# EAGLE design clock_arm (EAGLE 5.11)
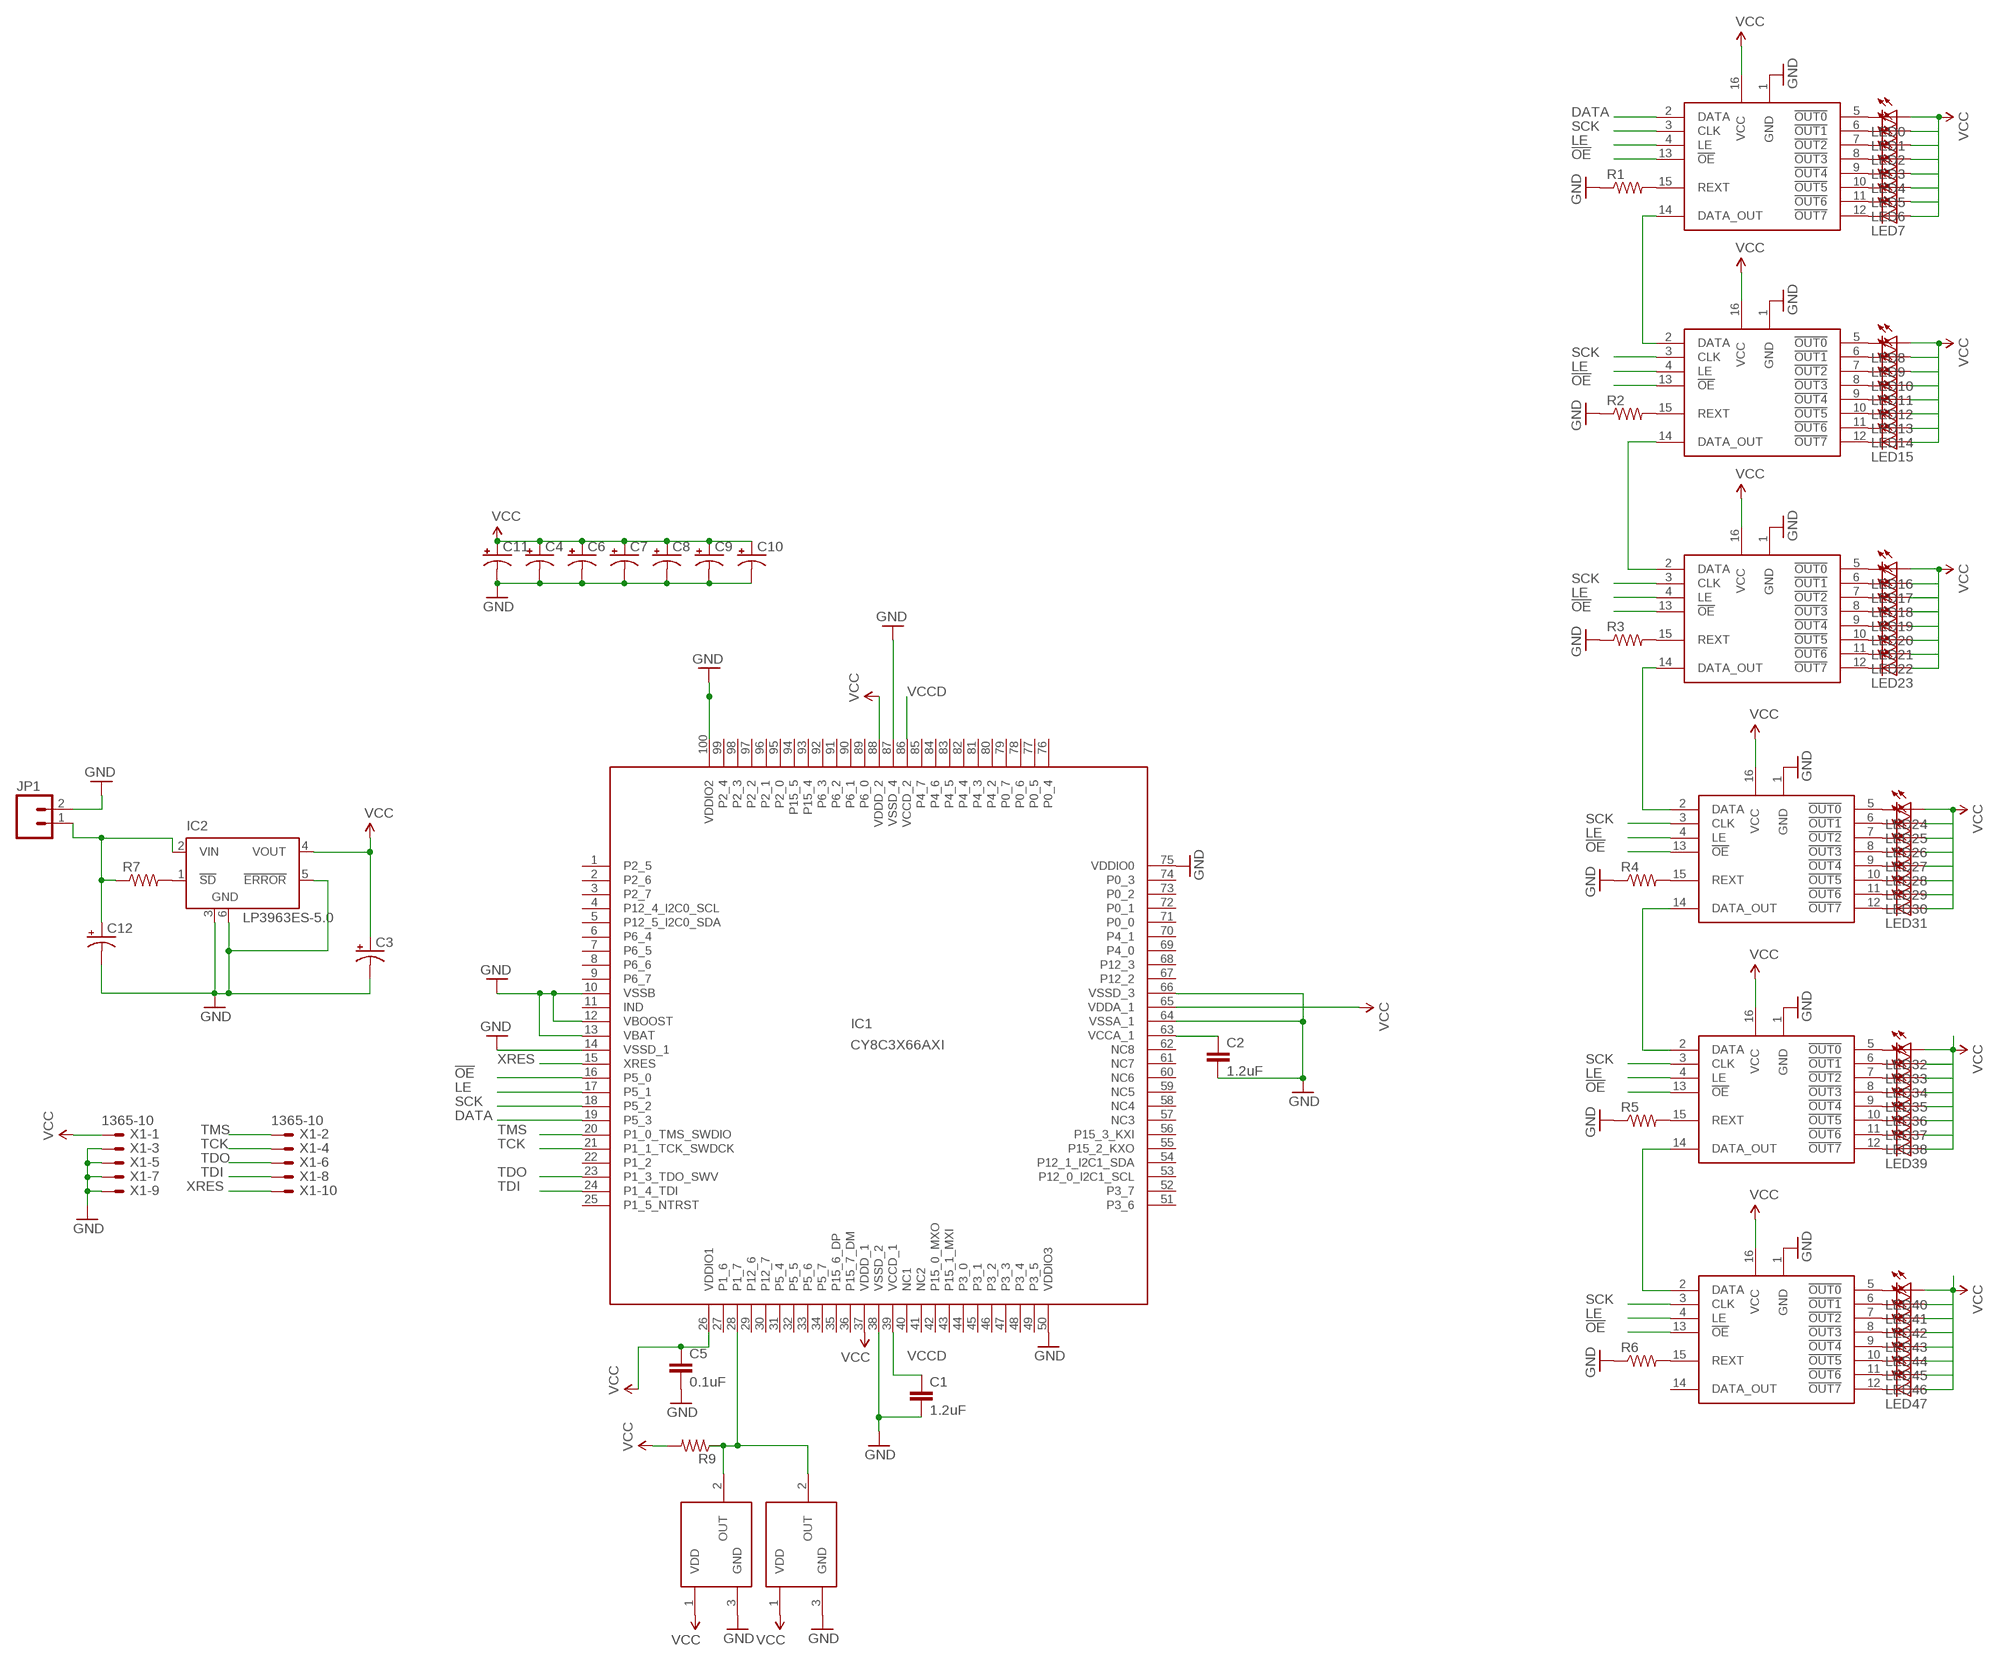
[diagram p0: schematic, sheet 1]

## Parts
C1  1.2uF  CAP0805  [0805]
C2  1.2uF  CAP0805  [0805]
C3  CAP_POL7343  [EIA7343]
C4  CAP_POL1206  [EIA3216]
C5  0.1uF  CAP0805  [0805]
C6  CAP_POL1206  [EIA3216]
C7  CAP_POL1206  [EIA3216]
C8  CAP_POL1206  [EIA3216]
C9  CAP_POL1206  [EIA3216]
C10  CAP_POL1206  [EIA3216]
C11  CAP_POL1206  [EIA3216]
C12  CAP_POL7343  [EIA7343]
IC1  CY8C3X66AXI  [TQFP-100]
IC2  LP3963ES-5.0  [TO263-5]
JP1  M02PTH  [1X02]
LED0  LG_T679-E1F1-1  [PLCC2]
LED1  LG_T679-E1F1-1  [PLCC2]
LED2  LG_T679-E1F1-1  [PLCC2]
LED3  LG_T679-E1F1-1  [PLCC2]
LED4  LG_T679-E1F1-1  [PLCC2]
LED5  LG_T679-E1F1-1  [PLCC2]
LED6  LG_T679-E1F1-1  [PLCC2]
LED7  LG_T679-E1F1-1  [PLCC2]
LED8  LG_T679-E1F1-1  [PLCC2]
LED9  LG_T679-E1F1-1  [PLCC2]
LED10  LG_T679-E1F1-1  [PLCC2]
LED11  LG_T679-E1F1-1  [PLCC2]
LED12  LG_T679-E1F1-1  [PLCC2]
LED13  LG_T679-E1F1-1  [PLCC2]
LED14  LG_T679-E1F1-1  [PLCC2]
LED15  LG_T679-E1F1-1  [PLCC2]
LED16  LG_T679-E1F1-1  [PLCC2]
LED17  LG_T679-E1F1-1  [PLCC2]
LED18  LG_T679-E1F1-1  [PLCC2]
LED19  LG_T679-E1F1-1  [PLCC2]
LED20  LG_T679-E1F1-1  [PLCC2]
LED21  LG_T679-E1F1-1  [PLCC2]
LED22  LG_T679-E1F1-1  [PLCC2]
LED23  LG_T679-E1F1-1  [PLCC2]
LED24  LG_T679-E1F1-1  [PLCC2]
LED25  LG_T679-E1F1-1  [PLCC2]
LED26  LG_T679-E1F1-1  [PLCC2]
LED27  LG_T679-E1F1-1  [PLCC2]
LED28  LG_T679-E1F1-1  [PLCC2]
LED29  LG_T679-E1F1-1  [PLCC2]
LED30  LG_T679-E1F1-1  [PLCC2]
LED31  LG_T679-E1F1-1  [PLCC2]
LED32  LG_T679-E1F1-1  [PLCC2]
LED33  LG_T679-E1F1-1  [PLCC2]
LED34  LG_T679-E1F1-1  [PLCC2]
LED35  LG_T679-E1F1-1  [PLCC2]
LED36  LG_T679-E1F1-1  [PLCC2]
LED37  LG_T679-E1F1-1  [PLCC2]
LED38  LG_T679-E1F1-1  [PLCC2]
LED39  LG_T679-E1F1-1  [PLCC2]
LED40  LG_T679-E1F1-1  [PLCC2]
LED41  LG_T679-E1F1-1  [PLCC2]
LED42  LG_T679-E1F1-1  [PLCC2]
LED43  LG_T679-E1F1-1  [PLCC2]
LED44  LG_T679-E1F1-1  [PLCC2]
LED45  LG_T679-E1F1-1  [PLCC2]
LED46  LG_T679-E1F1-1  [PLCC2]
LED47  LG_T679-E1F1-1  [PLCC2]
R1  RESISTOR0603-RES  [0603-RES]
R2  RESISTOR0603-RES  [0603-RES]
R3  RESISTOR0603-RES  [0603-RES]
R4  RESISTOR0603-RES  [0603-RES]
R5  RESISTOR0603-RES  [0603-RES]
R6  RESISTOR0603-RES  [0603-RES]
R7  RESISTOR0603-RES  [0603-RES]
R9  RESISTOR0603-RES  [0603-RES]
U$1  TLC5916TSSOP  [TSSOP-16]
U$2  TLC5916TSSOP  [TSSOP-16]
U$3  TLC5916TSSOP  [TSSOP-16]
U$4  TLC5916TSSOP  [TSSOP-16]
U$5  TLC5916TSSOP  [TSSOP-16]
U$6  TLC5916TSSOP  [TSSOP-16]
U$7  SS351AT  [SOT23-3]
U$9  SS351AT  [SOT23-3]
X1  1365-10  [1365-10]

## Nets
!OE: IC1.16(P5_0) U$1.13(!OE) U$2.13(!OE) U$3.13(!OE) U$4.13(!OE) U$5.13(!OE) U$6.13(!OE)
DATA: IC1.19(P5_3) U$1.2(DATA)
GND: C1.2 C2.2 C3.C(-) C4.C(-) C5.2 C6.C(-) C7.C(-) C8.C(-) C9.C(-) C10.C(-) C11.C(-) C12.C(-) IC1.10(VSSB) IC1.12(VBOOST) IC1.13(VBAT) IC1.14(VSSD_1) IC1.38(VSSD_2) IC1.50(VDDIO3) IC1.64(VSSA_1) IC1.66(VSSD_3) IC1.75(VDDIO0) IC1.87(VSSD_4) IC1.100(VDDIO2) IC2.3(GND) IC2.5(!ERROR) IC2.6(GND) JP1.2 R1.1 R2.1 R3.1 R4.1 R5.1 R6.1 U$1.1(GND) U$2.1(GND) U$3.1(GND) U$4.1(GND) U$5.1(GND) U$6.1(GND) U$7.3(GND) U$9.3(GND) X1.3 X1.5 X1.7 X1.9
LE: IC1.17(P5_1) U$1.4(LE) U$2.4(LE) U$3.4(LE) U$4.4(LE) U$5.4(LE) U$6.4(LE)
N$1: LED0.C U$1.5(!OUT0)
N$2: LED1.C U$1.6(!OUT1)
N$3: LED2.C U$1.7(!OUT2)
N$4: LED3.C U$1.8(!OUT3)
N$5: LED4.C U$1.9(!OUT4)
N$6: LED5.C U$1.10(!OUT5)
N$7: LED6.C U$1.11(!OUT6)
N$8: LED7.C U$1.12(!OUT7)
N$9: R1.2 U$1.15(REXT)
N$10: LED8.C U$2.5(!OUT0)
N$11: LED9.C U$2.6(!OUT1)
N$12: LED10.C U$2.7(!OUT2)
N$13: LED11.C U$2.8(!OUT3)
N$14: LED12.C U$2.9(!OUT4)
N$15: LED13.C U$2.10(!OUT5)
N$16: LED14.C U$2.11(!OUT6)
N$17: LED15.C U$2.12(!OUT7)
N$18: R2.2 U$2.15(REXT)
N$19: LED16.C U$3.5(!OUT0)
N$20: LED17.C U$3.6(!OUT1)
N$21: LED18.C U$3.7(!OUT2)
N$22: LED19.C U$3.8(!OUT3)
N$23: LED20.C U$3.9(!OUT4)
N$24: LED21.C U$3.10(!OUT5)
N$25: LED22.C U$3.11(!OUT6)
N$26: LED23.C U$3.12(!OUT7)
N$27: R3.2 U$3.15(REXT)
N$28: LED24.C U$4.5(!OUT0)
N$29: LED25.C U$4.6(!OUT1)
N$30: LED26.C U$4.7(!OUT2)
N$31: LED27.C U$4.8(!OUT3)
N$32: LED28.C U$4.9(!OUT4)
N$33: LED29.C U$4.10(!OUT5)
N$34: LED30.C U$4.11(!OUT6)
N$35: LED31.C U$4.12(!OUT7)
N$36: R4.2 U$4.15(REXT)
N$37: U$1.14(DATA_OUT) U$2.2(DATA)
N$38: U$2.14(DATA_OUT) U$3.2(DATA)
N$39: U$3.14(DATA_OUT) U$4.2(DATA)
N$40: LED32.C U$5.5(!OUT0)
N$41: LED33.C U$5.6(!OUT1)
N$42: LED34.C U$5.7(!OUT2)
N$43: LED35.C U$5.8(!OUT3)
N$44: LED36.C U$5.9(!OUT4)
N$45: LED37.C U$5.10(!OUT5)
N$46: LED38.C U$5.11(!OUT6)
N$47: LED39.C U$5.12(!OUT7)
N$48: R5.2 U$5.15(REXT)
N$49: U$4.14(DATA_OUT) U$5.2(DATA)
N$50: LED40.C U$6.5(!OUT0)
N$51: LED41.C U$6.6(!OUT1)
N$52: LED42.C U$6.7(!OUT2)
N$53: LED43.C U$6.8(!OUT3)
N$54: LED44.C U$6.9(!OUT4)
N$55: LED45.C U$6.10(!OUT5)
N$56: LED46.C U$6.11(!OUT6)
N$57: LED47.C U$6.12(!OUT7)
N$58: R6.2 U$6.15(REXT)
N$59: U$5.14(DATA_OUT) U$6.2(DATA)
N$60: C12.A(+) IC2.2(VIN) JP1.1 R7.1
N$61: IC2.1(!SD) R7.2
N$80: C2.1 IC1.63(VCCA_1)
N$81: IC1.28(P1_7) R9.1 U$7.2(OUT) U$9.2(OUT)
SCK: IC1.18(P5_2) U$1.3(CLK) U$2.3(CLK) U$3.3(CLK) U$4.3(CLK) U$5.3(CLK) U$6.3(CLK)
TCK: IC1.21(P1_1_TCK_SWDCK) X1.4
TDI: IC1.24(P1_4_TDI) X1.8
TDO: IC1.23(P1_3_TDO_SWV) X1.6
TMS: IC1.20(P1_0_TMS_SWDIO) X1.2
VCC: C3.A(+) C4.A(+) C5.1 C6.A(+) C7.A(+) C8.A(+) C9.A(+) C10.A(+) C11.A(+) IC1.26(VDDIO1) IC1.37(VDDD_1) IC1.65(VDDA_1) IC1.88(VDDD_2) IC2.4(VOUT) LED0.A LED1.A LED2.A LED3.A LED4.A LED5.A LED6.A LED7.A LED8.A LED9.A LED10.A LED11.A LED12.A LED13.A LED14.A LED15.A LED16.A LED17.A LED18.A LED19.A LED20.A LED21.A LED22.A LED23.A LED24.A LED25.A LED26.A LED27.A LED28.A LED29.A LED30.A LED31.A LED32.A LED33.A LED34.A LED35.A LED36.A LED37.A LED38.A LED39.A LED40.A LED41.A LED42.A LED43.A LED44.A LED45.A LED46.A LED47.A R9.2 U$1.16(VCC) U$2.16(VCC) U$3.16(VCC) U$4.16(VCC) U$5.16(VCC) U$6.16(VCC) U$7.1(VDD) U$9.1(VDD) X1.1
VCCD: C1.1 IC1.39(VCCD_1) IC1.86(VCCD_2)
XRES: IC1.15(XRES) X1.10
Unconnected: IC1.1(P2_5) IC1.2(P2_6) IC1.3(P2_7) IC1.4(P12_4_I2C0_SCL) IC1.5(P12_5_I2C0_SDA) IC1.6(P6_4) IC1.7(P6_5) IC1.8(P6_6) IC1.9(P6_7) IC1.11(IND) IC1.22(P1_2) IC1.25(P1_5_NTRST) IC1.27(P1_6) IC1.29(P12_6) IC1.30(P12_7) IC1.31(P5_4) IC1.32(P5_5) IC1.33(P5_6) IC1.34(P5_7) IC1.35(P15_6_DP) IC1.36(P15_7_DM) IC1.40(NC1) IC1.41(NC2) IC1.42(P15_0_MXO) IC1.43(P15_1_MXI) IC1.44(P3_0) IC1.45(P3_1) IC1.46(P3_2) IC1.47(P3_3) IC1.48(P3_4) IC1.49(P3_5) IC1.51(P3_6) IC1.52(P3_7) IC1.53(P12_0_I2C1_SCL) IC1.54(P12_1_I2C1_SDA) IC1.55(P15_2_KXO) IC1.56(P15_3_KXI) IC1.57(NC3) IC1.58(NC4) IC1.59(NC5) IC1.60(NC6) IC1.61(NC7) IC1.62(NC8) IC1.67(P12_2) IC1.68(P12_3) IC1.69(P4_0) IC1.70(P4_1) IC1.71(P0_0) IC1.72(P0_1) IC1.73(P0_2) IC1.74(P0_3) IC1.76(P0_4) IC1.77(P0_5) IC1.78(P0_6) IC1.79(P0_7) IC1.80(P4_2) IC1.81(P4_3) IC1.82(P4_4) IC1.83(P4_5) IC1.84(P4_6) IC1.85(P4_7) IC1.89(P6_0) IC1.90(P6_1) IC1.91(P6_2) IC1.92(P6_3) IC1.93(P15_4) IC1.94(P15_5) IC1.95(P2_0) IC1.96(P2_1) IC1.97(P2_2) IC1.98(P2_3) IC1.99(P2_4) U$6.14(DATA_OUT)

## Library data of the parts
C1 C2 C5 = SparkFun:CAP: Capacitor Standard 0603 ceramic capacitor, and 0.1" leaded capacitor.
C3 C4 C6-C12 = SparkFun:CAP_POL: Capacitor Polarized These are standard SMD and PTH capacitors. Normally 10uF, 47uF, and 100uF in electrolytic and tantalum varieties. Always verify the external diameter of the through hole cap, it varies with capacity, voltage, and manufacturer. The EIA devices should be standard.
IC1 = PSoC3:CY8C3X66AXI: CY8C_pins edit this description Auto generated by make-symbol-device-package-bsdl.ulp Rev. 34 Source: CY8C_pins.txt
IC2 = linear:LP3963?*: 3A Fast Ultra Low Dropout Linear Regulator Source: http://cache.national.com/ds/LP/LP3963.pdf
JP1 = SparkFun:M02: Header 2 Standard 2-pin 0.1" header. Use with straight break away headers (SKU : PRT-00116), right angle break away headers (PRT-00553), swiss pins (PRT-00743), machine pins (PRT-00117), and female headers (PRT-00115). Molex polarized connector foot print use with SKU : PRT-08233 with associated crimp pins and housings.
LED0 LED1-LED47 = led:*_T679-?-1: LC TOPLED® Low Current LED Source: http://catalog.osram-os.com .. LG_LS_LY_T679_OBS.pdf; COLOR: green
R1-R7 R9 = SparkFun:RESISTOR: Resistor Basic schematic elements and footprints for 0603, 1206, and PTH resistors.
U$1-U$6 = SparkFun:TLC5916
U$7 U$9 = SparkFun:SS351AT
X1 = con-leotronics:1365-10: DUAL ROW STRAIGHT HEADER 1364 SERIES. 1.27mm x 1.27mm. Without Fixing Post. SMT Source: http://www.leotronics.co.uk/Conexcon/Data%20Sheets/sec.%20A/1364ing.pdf; OC_FARNELL: unknown; OC_NEWARK: unknown

## Board
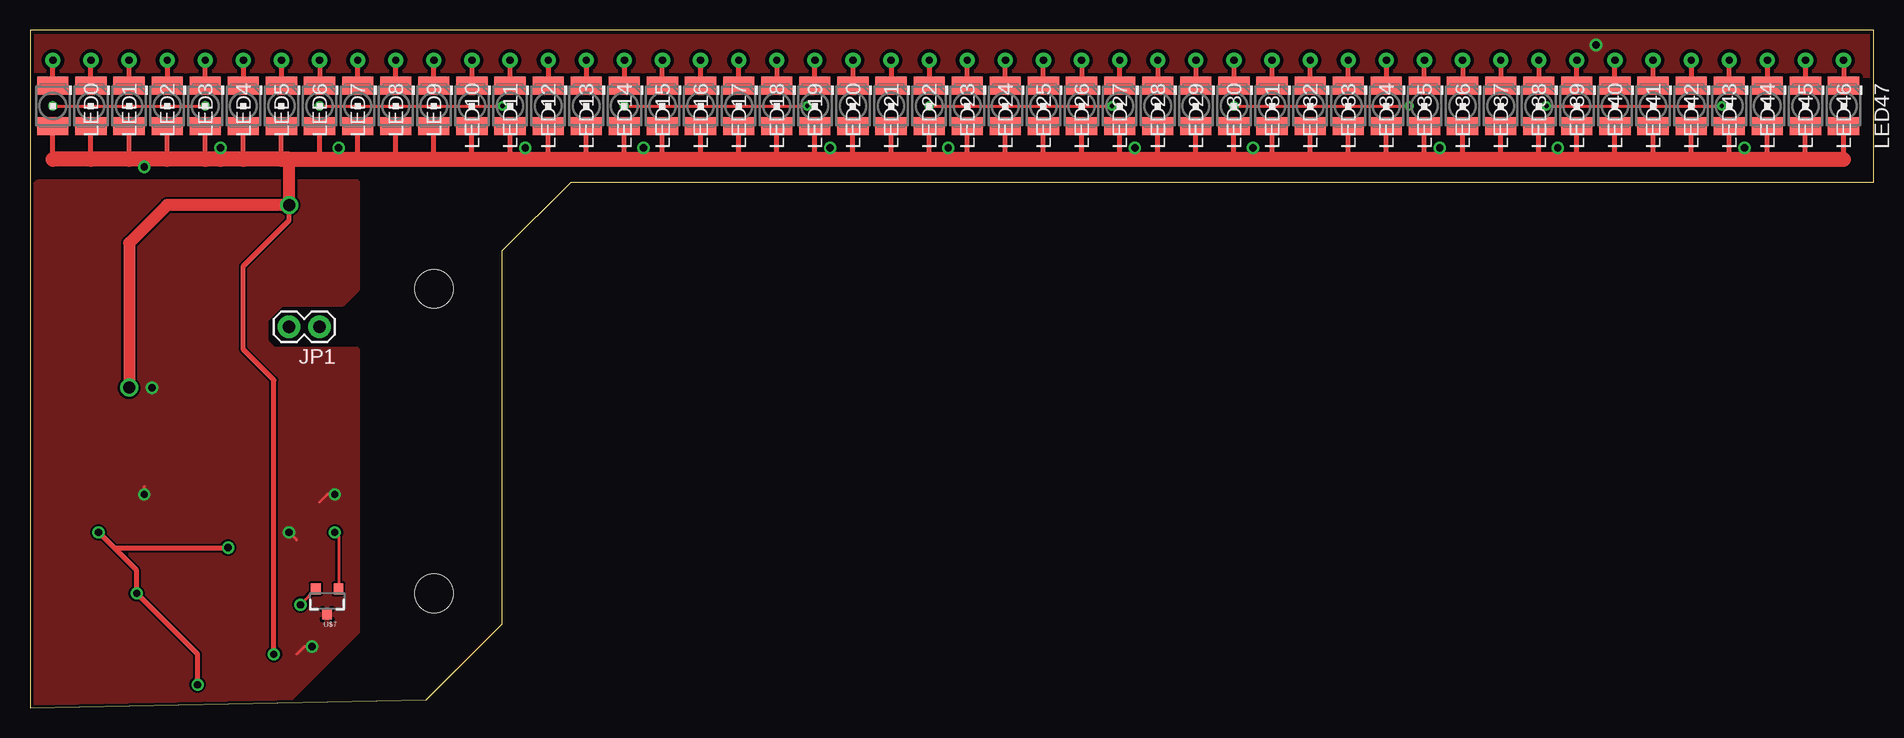
[diagram p1: board, top side]
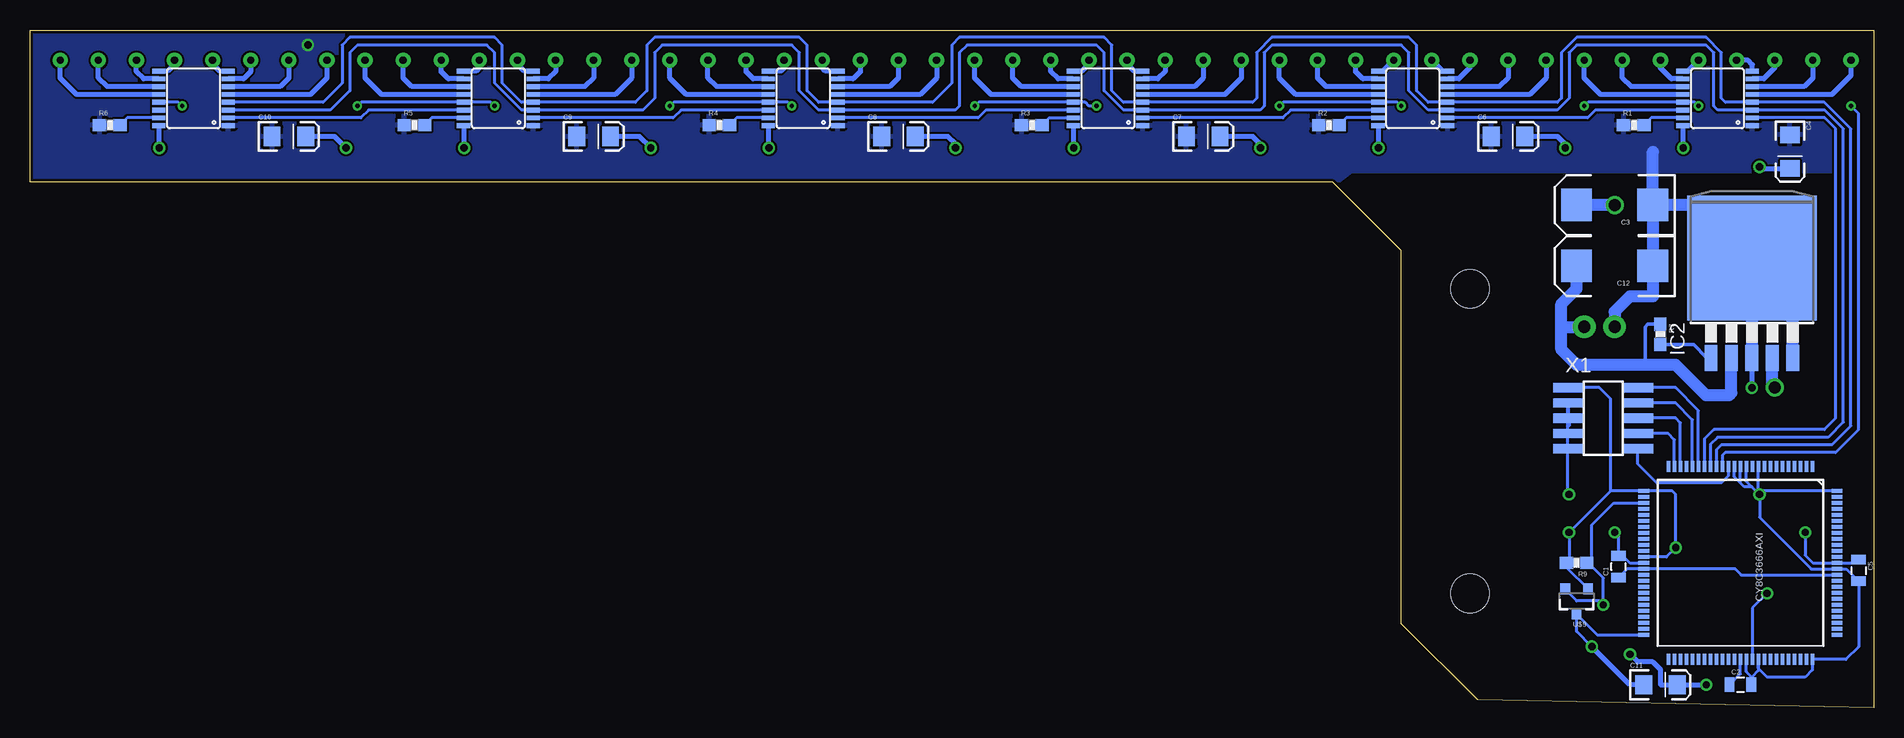
[diagram p2: board, bottom side, seen from below]

Size 153.65 x 56.5 mm. Coordinates in mm from the lower left corner, seen from the top.
Outline: 0,0 33.02,0.64 39.37,6.98 39.37,38.1 45.09,43.82 153.65,43.82 153.65,56.5 0,56.5 0,0
Copper layers (1*16): Top 0.035mm / dielectric 1.5mm / Bottom 0.035mm
Design rules "default *": minimum track width 10mil, minimum drill 14mil, track to track 7mil, track to pad 7mil, pad to pad 7mil, via to via 7mil, smd to smd 7mil, copper to edge 10mil, drill to drill 8mil, minimum pad ring 10mil, minimum via ring 8mil, stop-mask expansion 4mil, vias tented up to drill 0mil, thermal gap 10mil
Holes 3.2 mm at 33.66,9.53 33.66,34.92

### Footprints (pad centres in the part's own frame; a part is rotated, then mirrored left to right if it is on the bottom)
0805 = smd 0.8 x 1.2: 1 -0.9,0; 2 0.9,0
EIA7343 = smd 2.55 x 2.7: A 3.17,0; C -3.17,0
EIA3216 = smd 1.4 x 1.6: A 1.4,0; C -1.4,0
TQFP-100 = smd 0.9 x 0.3: 1 -8.05,6; 2 -8.05,5.5; 3 -8.05,5; 4 -8.05,4.5; 5 -8.05,4; 6 -8.05,3.5; 7 -8.05,3; 8 -8.05,2.5; 9 -8.05,2; 10 -8.05,1.5; 11 -8.05,1; 12 -8.05,0.5; 13 -8.05,0; 14 -8.05,-0.5; 15 -8.05,-1; 16 -8.05,-1.5; 17 -8.05,-2; 18 -8.05,-2.5; 19 -8.05,-3; 20 -8.05,-3.5; 21 -8.05,-4; 22 -8.05,-4.5; 23 -8.05,-5; 24 -8.05,-5.5; 25 -8.05,-6; 51 8.05,-6; 52 8.05,-5.5; 53 8.05,-5; 54 8.05,-4.5; 55 8.05,-4; 56 8.05,-3.5; 57 8.05,-3; 58 8.05,-2.5; 59 8.05,-2; 60 8.05,-1.5; 61 8.05,-1; 62 8.05,-0.5; 63 8.05,0; 64 8.05,0.5; 65 8.05,1; 66 8.05,1.5; 67 8.05,2; 68 8.05,2.5; 69 8.05,3; 70 8.05,3.5; 71 8.05,4; 72 8.05,4.5; 73 8.05,5; 74 8.05,5.5; 75 8.05,6 | smd 0.3 x 0.9: 26 -6,-8.05; 27 -5.5,-8.05; 28 -5,-8.05; 29 -4.5,-8.05; 30 -4,-8.05; 31 -3.5,-8.05; 32 -3,-8.05; 33 -2.5,-8.05; 34 -2,-8.05; 35 -1.5,-8.05; 36 -1,-8.05; 37 -0.5,-8.05; 38 0,-8.05; 39 0.5,-8.05; 40 1,-8.05; 41 1.5,-8.05; 42 2,-8.05; 43 2.5,-8.05; 44 3,-8.05; 45 3.5,-8.05; 46 4,-8.05; 47 4.5,-8.05; 48 5,-8.05; 49 5.5,-8.05; 50 6,-8.05; 76 6,8.05; 77 5.5,8.05; 78 5,8.05; 79 4.5,8.05; 80 4,8.05; 81 3.5,8.05; 82 3,8.05; 83 2.5,8.05; 84 2,8.05; 85 1.5,8.05; 86 1,8.05; 87 0.5,8.05; 88 0,8.05; 89 -0.5,8.05; 90 -1,8.05; 91 -1.5,8.05; 92 -2,8.05; 93 -2.5,8.05; 94 -3,8.05; 95 -3.5,8.05; 96 -4,8.05; 97 -4.5,8.05; 98 -5,8.05; 99 -5.5,8.05; 100 -6,8.05
TO263-5 = smd 1.067 x 2.159: 1 -3.404,-5.791; 2 -1.702,-5.791; 3 0,-5.791; 4 1.702,-5.791; 5 3.404,-5.791 | smd 10.8 x 10.41: 6 0,2.54
1X02 = drill 1.016 pad 1.88 round: 1 0,0; 2 2.54,0
PLCC2 = smd 2.6 x 1.5: A 0,1.7; C 0,-1.7
0603-RES = smd 1.1 x 1: 1 -0.85,0; 2 0.85,0
TSSOP-16 = smd 0.4 x 1.1: 1 -2.275,-2.9; 2 -1.625,-2.9; 3 -0.975,-2.9; 4 -0.325,-2.9; 5 0.325,-2.9; 6 0.975,-2.9; 7 1.625,-2.9; 8 2.275,-2.9; 9 2.275,2.9; 10 1.625,2.9; 11 0.975,2.9; 12 0.325,2.9; 13 -0.325,2.9; 14 -0.975,2.9; 15 -1.625,2.9; 16 -2.275,2.9
SOT23-3 = smd 0.8 x 0.9: 1 -0.95,-1; 2 0.95,-1; 3 0,1.1
1365-10 = smd 0.76 x 2.4: 1 -2.54,-2.95; 2 -2.54,2.95; 3 -1.27,-2.95; 4 -1.27,2.95; 5 0,-2.95; 6 0,2.95; 7 1.27,-2.95; 8 1.27,2.95; 9 2.54,-2.95; 10 2.54,2.95

### Placement (x,y rotation side)
C1  21.27,11.75 90 bottom
C2  11.11,1.91 0 bottom
C3  21.59,41.91 180 bottom
C4  6.98,46.36 270 bottom
C5  1.27,11.43 270 bottom
C6  30.48,47.62 0 bottom
C7  55.88,47.62 0 bottom
C8  81.28,47.62 0 bottom
C9  106.68,47.62 0 bottom
C10  132.08,47.62 0 bottom
C11  17.78,1.91 0 bottom
C12  21.59,36.83 180 bottom
IC1  11.11,12.07 270 bottom
IC2  10.16,34.92 0 bottom
JP1  24.13,31.75 180 top
LED0  1.9,50.16 180 top
LED1  5.08,50.16 180 top
LED2  8.26,50.16 180 top
LED3  11.43,50.16 180 top
LED4  14.6,50.16 180 top
LED5  17.78,50.16 180 top
LED6  20.95,50.16 180 top
LED7  24.13,50.16 180 top
LED8  27.3,50.16 180 top
LED9  30.48,50.16 180 top
LED10  33.66,50.16 180 top
LED11  36.83,50.16 180 top
LED12  40.01,50.16 180 top
LED13  43.18,50.16 180 top
LED14  46.35,50.16 180 top
LED15  49.53,50.16 180 top
LED16  52.71,50.16 180 top
LED17  55.88,50.16 180 top
LED18  59.05,50.16 180 top
LED19  62.23,50.16 180 top
LED20  65.41,50.16 180 top
LED21  68.58,50.16 180 top
LED22  71.75,50.16 180 top
LED23  74.93,50.16 180 top
LED24  78.1,50.16 180 top
LED25  81.28,50.16 180 top
LED26  84.46,50.16 180 top
LED27  87.63,50.16 180 top
LED28  90.81,50.16 180 top
LED29  93.98,50.16 180 top
LED30  97.16,50.16 180 top
LED31  100.33,50.16 180 top
LED32  103.5,50.16 180 top
LED33  106.68,50.16 180 top
LED34  109.85,50.16 180 top
LED35  113.03,50.16 180 top
LED36  116.2,50.16 180 top
LED37  119.38,50.16 180 top
LED38  122.55,50.16 180 top
LED39  125.73,50.16 180 top
LED40  128.91,50.16 180 top
LED41  132.08,50.16 180 top
LED42  135.25,50.16 180 top
LED43  138.43,50.16 180 top
LED44  141.6,50.16 180 top
LED45  144.78,50.16 180 top
LED46  147.95,50.16 180 top
LED47  151.13,50.16 180 top
R1  20,48.58 0 bottom
R2  45.4,48.58 0 bottom
R3  70.17,48.58 0 bottom
R4  96.2,48.58 0 bottom
R5  121.6,48.58 0 bottom
R6  147,48.58 0 bottom
R7  17.78,31.12 270 bottom
R9  24.77,12.07 180 bottom
U$1  13.02,50.8 90 bottom
U$2  38.42,50.8 90 bottom
U$3  63.82,50.8 90 bottom
U$4  89.22,50.8 90 bottom
U$5  114.62,50.8 90 bottom
U$6  140.02,50.8 90 bottom
U$7  24.77,8.89 180 top
U$9  24.77,8.89 180 bottom
X1  22.54,24.13 270 bottom

### Tracks (layer width: path | path; a pad name or v marks a point on that pad's centre or on a via)
!OE  (via drill 0.36)
  Top 0.254: v24.13,50.16 v39.37,50.16 | v49.53,50.16 v64.77,50.16 | v1.9,50.16 v14.6,50.16 | v74.93,50.16 v90.17,50.16 | v100.33,50.16 v114.94,50.16 | v126.36,50.16 v140.97,50.16
  Bottom 0.254: v24.13,50.16 23.8,50.48 U$1.13 14.93,50.48 v14.6,50.16 | v39.37,50.16 39.7,50.48 U$2.13 49.21,50.48 v49.53,50.16 | v64.77,50.16 65.41,50.16 65.73,50.48 U$3.13 74.6,50.48 v74.93,50.16 | v1.9,50.16 1.27,49.53 1.27,23.18 3.17,21.27 12.38,21.27 12.61,21.04 IC1.16 | v90.17,50.16 90.5,50.48 U$4.13 100,50.48 v100.33,50.16 | v114.94,50.16 115.26,50.48 U$5.13 126.04,50.48 v126.36,50.16 | U$6.13 141.29,50.48 v140.97,50.16
DATA
  Bottom 0.254: U$1.2 4.09,49.18 3.17,48.26 3.17,24.13 4.13,23.18 13.34,23.18 14.11,22.4 IC1.19
GND  (via drill 0.61)
  Top 0.254: v9.52,17.78 9.52,18.41 | v23.49,5.08 22.86,5.08 22.23,4.45 | v21.59,14.61 22.23,13.97 | v25.4,17.78 24.77,17.78 24.13,17.15
  Bottom 0.254: IC1.10 9.61,17.87 v9.52,17.78 | IC1.12 10.61,18.87 10.16,18.41 | v9.52,17.78 10.16,18.41 | 11.11,18.73 IC1.13 | 11.11,18.73 10.8,18.41 10.16,18.41 | IC1.14 11.61,19.23 11.11,18.73 | IC1.100 9.24,18.07 v9.52,17.78 | v9.52,17.78 9.52,15.88 5.21,11.57 IC1.87 2.3,11.57 C5.2 1.27,5.08 2.34,4.02 IC1.75 5.11,3.14 5.71,2.54 8.89,2.54 9.61,3.26 IC1.66 9.61,3.09 10.16,2.54 | IC1.38 20.32,12.07 20.9,12.65 C1.2 21.27,14.29 v21.59,14.61 | IC1.64 10.61,2.99 10.16,2.54 | 10.16,2.54 10.16,1.96 C2.2 | IC1.50 23.04,6.07 U$7.3 24.77,6.35 v23.49,5.08 | X1.5 X1.3 25.4,23.5 25.49,23.4 X1.5 | v25.4,17.78 25.49,17.87 X1.9 X1.7 X1.5
  Bottom 0.305: 6.98,34.29 10.16,34.29
  Bottom 0.406: IC2.3 v10.16,26.67 | C11.C 20.32,1.91 v23.49,5.08
  Bottom 1.016: C3.C 18.42,46.35 18.41,46.36 | IC2.3 10.16,34.29 IC2.6 13.34,41.91 C3.C | IC2.5 6.76,34.06 6.98,34.29 | C3.C C12.C 18.42,34.29 20.32,34.29 21.59,33.02 JP1.2
  other vias: 130.49,55.25
  pour Bottom: 0,56.2 153.35,56.2 153.67,55.88 153.67,44.45 153.35,43.82 44.77,43.82 43.5,44.77 0,44.77
  pour Top (isolate 0.305): 0,56.52 153.67,56.52 153.67,52.71 0,52.71
  pour Top: 0,0 20.95,0 27.3,6.35 27.3,29.85 20.32,29.85 19.69,30.48 19.69,32.39 20.95,33.66 26.03,33.66 27.3,34.92 27.3,43.82 0.63,43.82 0,43.18
LE
  Bottom 0.254: U$6.4 129.23,50.48 127.63,52.07 127.63,55.25 127,55.88 114.94,55.88 114.3,55.25 114.3,52.07 112.7,50.48 U$5.4 103.19,50.48 102.23,51.44 102.23,55.25 101.6,55.88 89.53,55.88 88.9,55.25 88.9,51.44 87.94,50.48 U$4.4 78.43,50.48 76.84,52.07 76.84,55.25 76.2,55.88 64.13,55.88 63.5,55.25 63.5,51.44 62.54,50.48 U$3.4 51.76,50.48 51.43,50.8 51.43,54.61 50.16,55.88 38.73,55.88 38.1,55.25 38.1,51.44 37.14,50.48 U$2.4 26.36,50.48 26.03,50.8 26.03,54.61 24.77,55.88 13.97,55.88 12.7,54.61 12.7,50.8 12.38,50.48 U$1.4 4.12,50.48 1.9,48.26 1.9,23.5 3.49,21.91 12.7,21.91 13.11,21.5 IC1.17
N$1  (via drill 0.61 pad 1.27)
  Top 0.406: LED0.C v1.9,53.98
  Bottom 0.406: v1.9,53.98 1.9,52.71 3.49,51.12 3.5,51.12 U$1.5
N$2  (via drill 0.61 pad 1.27)
  Top 0.406: LED1.C v5.08,53.98
  Bottom 0.406: U$1.6 5.8,51.78 5.08,52.5 v5.08,53.98
N$3  (via drill 0.61 pad 1.27)
  Top 0.406: LED2.C v8.26,53.98
  Bottom 0.406: U$1.7 9.17,52.43 8.26,53.34 v8.26,53.98
N$4  (via drill 0.61 pad 1.27)
  Top 0.406: v11.43,53.98 LED3.C
  Bottom 0.406: U$1.8 10.12,53.62 10.48,53.98 v11.43,53.98
N$5  (via drill 0.61 pad 1.27)
  Top 0.406: LED4.C v14.6,53.98
  Bottom 0.406: U$1.9 15.51,53.08 v14.6,53.98
N$6  (via drill 0.61 pad 1.27)
  Top 0.406: v17.78,53.98 LED5.C
  Bottom 0.406: U$1.10 16.87,52.43 17.78,53.34 v17.78,53.98
N$7  (via drill 0.61 pad 1.27)
  Top 0.406: v20.95,53.98 LED6.C
  Bottom 0.406: U$1.11 20.23,51.78 20.95,52.5 v20.95,53.98
N$8  (via drill 0.61 pad 1.27)
  Top 0.406: v24.13,53.98 LED7.C
  Bottom 0.406: U$1.12 22.76,51.12 24.13,52.5 v24.13,53.98
N$9
  Bottom 0.254: U$1.15 18.55,49.18 R1.2
N$10  (via drill 0.61 pad 1.27)
  Top 0.406: LED8.C v27.3,53.98
  Bottom 0.406: U$2.5 28.68,51.12 27.3,52.5 v27.3,53.98
N$11  (via drill 0.61 pad 1.27)
  Top 0.406: LED9.C v30.48,53.98
  Bottom 0.406: U$2.6 31.2,51.78 30.48,52.5 v30.48,53.98
N$12  (via drill 0.61 pad 1.27)
  Top 0.406: LED10.C v33.66,53.98
  Bottom 0.406: U$2.7 34.57,52.43 33.66,53.34 v33.66,53.98
N$13  (via drill 0.61 pad 1.27)
  Top 0.406: v36.83,53.98 LED11.C
  Bottom 0.406: U$2.8 35.93,53.08 v36.83,53.98
N$14  (via drill 0.61 pad 1.27)
  Top 0.406: LED12.C v40.01,53.98
  Bottom 0.406: U$2.9 40.9,53.08 v40.01,53.98
N$15  (via drill 0.61 pad 1.27)
  Top 0.406: v43.18,53.98 LED13.C
  Bottom 0.406: U$2.10 42.58,52.43 43.18,53.02 v43.18,53.98
N$16  (via drill 0.61 pad 1.27)
  Top 0.406: v46.35,53.98 LED14.C
  Bottom 0.406: U$2.11 45.63,51.78 46.35,52.5 v46.35,53.98
N$17  (via drill 0.61 pad 1.27)
  Top 0.406: v49.53,53.98 LED15.C
  Bottom 0.406: U$2.12 48.15,51.12 49.53,52.5 v49.53,53.98
N$18
  Bottom 0.254: U$2.15 43.96,49.18 R2.2
N$19  (via drill 0.61 pad 1.27)
  Top 0.406: LED16.C v52.71,53.98
  Bottom 0.406: U$3.5 54.08,51.12 52.71,52.5 v52.71,53.98
N$20  (via drill 0.61 pad 1.27)
  Top 0.406: LED17.C v55.88,53.98
  Bottom 0.406: U$3.6 56.6,51.78 55.88,52.5 v55.88,53.98
N$21  (via drill 0.61 pad 1.27)
  Top 0.406: 59.05,53.02 LED18.C v59.05,53.98
  Bottom 0.406: U$3.7 59.65,52.43 59.05,53.02 v59.05,53.98
N$22  (via drill 0.61 pad 1.27)
  Top 0.406: v62.23,53.98 LED19.C
  Bottom 0.406: U$3.8 61.65,53.08 62.23,53.66 v62.23,53.98
N$23  (via drill 0.61 pad 1.27)
  Top 0.406: LED20.C v65.41,53.98
  Bottom 0.406: U$3.9 65.99,53.08 65.41,53.66 v65.41,53.98
N$24  (via drill 0.61 pad 1.27)
  Top 0.406: v68.58,53.98 LED21.C
  Bottom 0.406: U$3.10 67.98,52.43 68.58,53.02 v68.58,53.98
N$25  (via drill 0.61 pad 1.27)
  Top 0.406: v71.75,53.98 LED22.C
  Bottom 0.406: U$3.11 71.03,51.78 71.75,52.5 v71.75,53.98
N$26  (via drill 0.61 pad 1.27)
  Top 0.406: v74.93,53.98 LED23.C
  Bottom 0.406: U$3.12 73.56,51.12 74.93,52.5 v74.93,53.98
N$27
  Bottom 0.254: U$3.15 68.72,49.18 R3.2
N$28  (via drill 0.61 pad 1.27)
  Top 0.406: LED24.C v78.1,53.98
  Bottom 0.406: U$4.5 79.48,51.12 78.1,52.5 v78.1,53.98
N$29  (via drill 0.61 pad 1.27)
  Top 0.406: LED25.C v81.28,53.98
  Bottom 0.406: U$4.6 82,51.78 81.28,52.5 v81.28,53.98
N$30  (via drill 0.61 pad 1.27)
  Top 0.406: LED26.C v84.46,53.98
  Bottom 0.406: U$4.7 85.05,52.43 84.46,53.02 v84.46,53.98
N$31  (via drill 0.61 pad 1.27)
  Top 0.406: v87.63,53.98 LED27.C
  Bottom 0.406: U$4.8 87.37,53.08 87.63,53.34 v87.63,53.98
N$32  (via drill 0.61 pad 1.27)
  Top 0.406: LED28.C v90.81,53.98
  Bottom 0.406: U$4.9 91.07,53.08 90.81,53.34 v90.81,53.98
N$33  (via drill 0.61 pad 1.27)
  Top 0.406: v93.98,53.98 LED29.C
  Bottom 0.406: U$4.10 93.38,52.43 93.98,53.02 v93.98,53.98
N$34  (via drill 0.61 pad 1.27)
  Top 0.406: v97.16,53.98 LED30.C
  Bottom 0.406: U$4.11 96.43,51.78 97.16,52.5 v97.16,53.98
N$35  (via drill 0.61 pad 1.27)
  Top 0.406: v100.33,53.98 LED31.C
  Bottom 0.406: U$4.12 98.95,51.12 100.33,52.5 v100.33,53.98
N$36
  Bottom 0.254: U$4.15 94.75,49.18 R4.2
N$37
  Bottom 0.254: U$1.14 23.2,49.83 23.85,49.18 U$2.2
N$38
  Bottom 0.254: U$2.14 48.6,49.83 49.25,49.18 U$3.2
N$39
  Bottom 0.254: U$3.14 74,49.83 74.65,49.18 U$4.2
N$40  (via drill 0.61 pad 1.27)
  Top 0.406: LED32.C v103.5,53.98
  Bottom 0.406: U$5.5 104.88,51.12 103.5,52.5 v103.5,53.98
N$41  (via drill 0.61 pad 1.27)
  Top 0.406: LED33.C v106.68,53.98
  Bottom 0.406: U$5.6 107.41,51.78 106.68,52.5 v106.68,53.98
N$42  (via drill 0.61 pad 1.27)
  Top 0.406: LED34.C v109.85,53.98
  Bottom 0.406: U$5.7 110.45,52.43 109.85,53.02 v109.85,53.98
N$43  (via drill 0.61 pad 1.27)
  Top 0.406: v113.03,53.98 LED35.C
  Bottom 0.406: U$5.8 112.45,53.08 113.03,53.66 v113.03,53.98
N$44  (via drill 0.61 pad 1.27)
  Top 0.406: LED36.C v116.2,53.98
  Bottom 0.406: U$5.9 116.47,53.08 116.2,53.34 v116.2,53.98
N$45  (via drill 0.61 pad 1.27)
  Top 0.406: v119.38,53.98 LED37.C
  Bottom 0.406: U$5.10 118.78,52.43 119.38,53.02 v119.38,53.98
N$46  (via drill 0.61 pad 1.27)
  Top 0.406: v122.55,53.98 LED38.C
  Bottom 0.406: U$5.11 121.83,51.78 122.55,52.5 v122.55,53.98
N$47  (via drill 0.61 pad 1.27)
  Top 0.406: v125.73,53.98 LED39.C
  Bottom 0.406: U$5.12 124.35,51.12 125.73,52.5 v125.73,53.98
N$48
  Bottom 0.254: U$5.15 120.16,49.18 R5.2
N$49
  Bottom 0.254: U$4.14 99.4,49.83 100.05,49.18 U$5.2
N$50  (via drill 0.61 pad 1.27)
  Top 0.406: LED40.C v128.91,53.98
  Bottom 0.406: U$6.5 130.28,51.12 128.91,52.5 v128.91,53.98
N$51  (via drill 0.61 pad 1.27)
  Top 0.406: LED41.C v132.08,53.98
  Bottom 0.406: U$6.6 132.8,51.78 132.08,52.5 v132.08,53.98
N$52  (via drill 0.61 pad 1.27)
  Top 0.406: LED42.C v135.25,53.98
  Bottom 0.406: U$6.7 135.85,52.43 135.25,53.02 v135.25,53.98
N$53  (via drill 0.61 pad 1.27)
  Top 0.406: v138.43,53.98 LED43.C
  Bottom 0.406: U$6.8 137.85,53.08 138.43,53.66 v138.43,53.98
N$54  (via drill 0.61 pad 1.27)
  Top 0.406: LED44.C v141.6,53.98
  Bottom 0.406: U$6.9 142.19,53.08 141.6,53.66 v141.6,53.98
N$55  (via drill 0.61 pad 1.27)
  Top 0.406: v144.78,53.98 LED45.C
  Bottom 0.406: U$6.10 144.18,52.43 144.78,53.02 v144.78,53.98
N$56  (via drill 0.61 pad 1.27)
  Top 0.406: v147.95,53.98 LED46.C
  Bottom 0.406: U$6.11 147.23,51.78 147.95,52.5 v147.95,53.98
N$57  (via drill 0.61 pad 1.27)
  Top 0.406: v151.13,53.98 LED47.C
  Bottom 0.406: U$6.12 149.75,51.12 151.13,52.5 v151.13,53.98
N$58
  Bottom 0.254: U$6.15 145.55,49.18 R6.2
N$59
  Bottom 0.254: U$5.14 125.44,49.83 126.08,49.18 U$6.2
N$60
  Bottom 0.305: R7.1 18.84,31.97 19.05,31.75 19.05,28.58
  Bottom 1.016: IC2.2 11.86,26.24 12.06,26.04 13.97,26.04 16.51,28.58 19.05,28.58 24.77,28.58 26.03,29.85 26.03,31.75 | 26.03,31.75 26.03,33.66 24.76,34.93 C12.A | 26.03,31.75 JP1.1
N$61
  Bottom 0.305: R7.2 15.02,30.27 13.97,29.21 13.64,29.21 IC2.1
N$80
  Bottom 0.254: IC1.63 11.11,2.8 C2.1
N$81  (via drill 0.61)
  Top 0.254: v22.54,8.57 22.54,8.62 U$7.2
  Bottom 0.254: IC1.28 21.67,17.07 23.49,15.24 23.49,12.48 R9.1 23.81,12.07 22.54,10.8 v22.54,8.57 22.86,8.89 24.77,8.89 25.71,9.84 U$9.2
SCK
  Bottom 0.254: U$6.3 128.61,49.83 127,51.44 127,54.61 126.36,55.25 115.57,55.25 114.94,54.61 114.94,52.07 112.69,49.83 U$5.3 102.57,49.83 101.6,50.8 101.6,54.61 100.97,55.25 90.17,55.25 89.53,54.61 89.53,51.44 87.93,49.83 U$4.3 76.54,49.83 76.2,50.16 76.2,54.61 75.56,55.25 64.77,55.25 64.13,54.61 64.13,51.44 62.52,49.83 U$3.3 51.14,49.83 50.8,50.16 50.8,54.61 50.16,55.25 39.37,55.25 38.73,54.61 38.73,51.44 37.12,49.83 U$2.3 26.38,49.83 25.4,50.8 25.4,54.61 24.77,55.25 13.97,55.25 13.34,54.61 13.34,50.16 12.99,49.83 U$1.3 4.1,49.83 2.54,48.26 2.54,23.81 3.81,22.54 13.02,22.54 13.61,21.95 IC1.18
TCK
  Bottom 0.254: IC1.21 15.11,24 16.51,25.4 X1.4
TDI
  Bottom 0.254: IC1.24 16.61,22.33 17.14,22.86 X1.8
TDO
  Bottom 0.254: IC1.23 16.11,23.73 16.51,24.13 X1.6
TMS
  Bottom 0.254: IC1.20 14.61,24.77 16.51,26.67 X1.2
VCC  (via drill 0.61, 1)
  Top 0.254: v5.71,14.61 6.98,13.34 | U$7.1 25.71,14.29 v25.4,14.61
  Top 0.406: 1.9,45.72 LED0.A | 5.08,45.72 LED1.A | 8.26,45.72 LED2.A | 11.43,45.72 LED3.A | 14.6,45.72 LED4.A | 17.78,45.72 LED5.A | 20.95,45.72 LED6.A | 24.13,45.72 LED7.A | 27.3,45.72 LED8.A | 30.48,45.72 LED9.A | 40.01,45.72 LED12.A | 43.18,45.72 LED13.A | 46.35,45.72 LED14.A | 49.53,45.72 LED15.A | 52.71,45.72 LED16.A | 55.88,45.72 LED17.A | 59.05,45.72 LED18.A | 62.23,45.72 LED19.A | 65.41,45.72 LED20.A | 68.58,45.72 LED21.A | 71.75,45.72 LED22.A | 74.93,45.72 LED23.A | 78.1,45.72 LED24.A | 81.28,45.72 LED25.A | 84.46,45.72 LED26.A | 87.63,45.72 LED27.A | 90.81,45.72 LED28.A | 93.98,45.72 LED29.A | 97.16,45.72 LED30.A | 100.33,45.72 LED31.A | 106.68,45.72 LED33.A | 109.85,45.72 LED34.A | 113.03,45.72 LED35.A | 116.2,45.72 LED36.A | 119.38,45.72 LED37.A | 122.55,45.72 LED38.A | 125.73,45.72 LED39.A | 141.6,45.72 LED44.A | 144.78,45.72 LED45.A | 147.95,45.72 LED46.A | 151.13,45.72 LED47.A | 33.66,45.72 LED10.A | 36.83,45.72 LED11.A | 128.91,45.72 LED40.A | 132.08,45.72 LED41.A | 135.25,45.72 LED42.A | 138.43,45.72 LED43.A | 15.88,45.72 v15.88,46.67 | 41.27,45.72 v41.27,46.67 | 66.68,45.72 v66.68,46.67 | 92.07,45.72 v92.07,46.67 | 117.47,45.72 v117.47,46.67 | 142.88,45.72 v142.88,46.67 | 108.58,45.72 108.27,46.04 | 9.52,45.72 v9.52,45.09 | 25.72,45.72 v25.72,46.67 | 51.12,45.72 v51.12,46.67 | v76.52,46.67 76.52,46.04 76.84,45.72 | 101.92,45.72 v101.92,46.67 | v127.32,46.67 127.32,46.04 127.63,45.72 | v5.71,14.61 8.89,11.43 v8.89,9.53 13.97,4.45 v13.97,1.91 | 6.98,13.34 v16.51,13.34 | 103.5,45.72 LED32.A | v20.32,4.45 20.32,27.31 17.78,29.85 17.78,36.83 21.59,40.64 v21.59,41.91
  Top 1.016: 21.59,45.72 v21.59,41.91 11.43,41.91 8.26,38.73 v8.26,26.67
  Top 1.27: 1.9,45.72 5.08,45.72 8.26,45.72 9.52,45.72 11.43,45.72 14.6,45.72 15.88,45.72 17.78,45.72 20.95,45.72 21.59,45.72 24.13,45.72 25.72,45.72 27.3,45.72 30.48,45.72 33.66,45.72 36.83,45.72 40.01,45.72 41.27,45.72 43.18,45.72 46.35,45.72 49.53,45.72 51.12,45.72 52.71,45.72 55.88,45.72 59.05,45.72 62.23,45.72 65.41,45.72 66.68,45.72 68.58,45.72 71.75,45.72 74.93,45.72 76.84,45.72 78.1,45.72 81.28,45.72 84.46,45.72 87.63,45.72 90.81,45.72 92.07,45.72 93.98,45.72 97.16,45.72 100.33,45.72 101.92,45.72 103.5,45.72 106.68,45.72 108.58,45.72 109.85,45.72 113.03,45.72 116.2,45.72 117.47,45.72 119.38,45.72 122.55,45.72 125.73,45.72 127.63,45.72 128.91,45.72 132.08,45.72 135.25,45.72 138.43,45.72 141.6,45.72 142.88,45.72 144.78,45.72 147.95,45.72 151.13,45.72
  Bottom 0.254: C5.1 1.54,12.07 IC1.88 5.08,12.07 5.71,12.7 v5.71,14.61 | IC1.37 17.28,12.57 v16.51,13.34 16.51,17.78 16.8,18.07 IC1.26 21.94,18.07 | IC1.65 10.11,8.3 v8.89,9.53 | U$9.1 25.62,11.69 R9.2 25.4,12.28 v25.4,14.61 21.94,18.07 | 21.94,18.07 21.94,25.75 22.86,26.67 X1.1
  Bottom 0.406: 15.88,48.53 U$1.16 | 15.88,48.53 15.4,48.53 | v15.88,46.67 15.88,48.53 | U$2.16 41.27,48.53 v41.27,46.67 | U$3.16 66.68,48.53 v66.68,46.67 | U$4.16 92.07,48.53 v92.07,46.67 | U$5.16 117.47,48.53 v117.47,46.67 | U$6.16 142.88,48.53 v142.88,46.67 | C4.A 9.39,44.95 v9.52,45.09 | C6.A 26.35,47.62 25.72,46.99 v25.72,46.67 | C7.A 51.75,47.62 51.12,46.99 v51.12,46.67 | C8.A 77.15,47.62 76.52,46.99 v76.52,46.67 | C9.A 102.87,47.62 v101.92,46.67 | C10.A 128.27,47.62 v127.32,46.67 | v20.32,4.45 19.69,3.81 18.41,3.81 17.78,3.18 17.78,1.91 C11.A v13.97,1.91
  Bottom 1.016: v21.59,41.91 C3.A | IC2.4 8.46,26.87 v8.26,26.67
VCCD
  Bottom 0.254: IC1.86 11.06,11.07 11.56,11.57 IC1.39 20.55,11.57 C1.1
XRES
  Bottom 0.254: IC1.15 12.11,19.32 12.7,18.73 18.1,18.73 19.69,20.32 19.69,21.5 X1.10